# EAGLE design Routing_option1 (EAGLE 9.6.2)
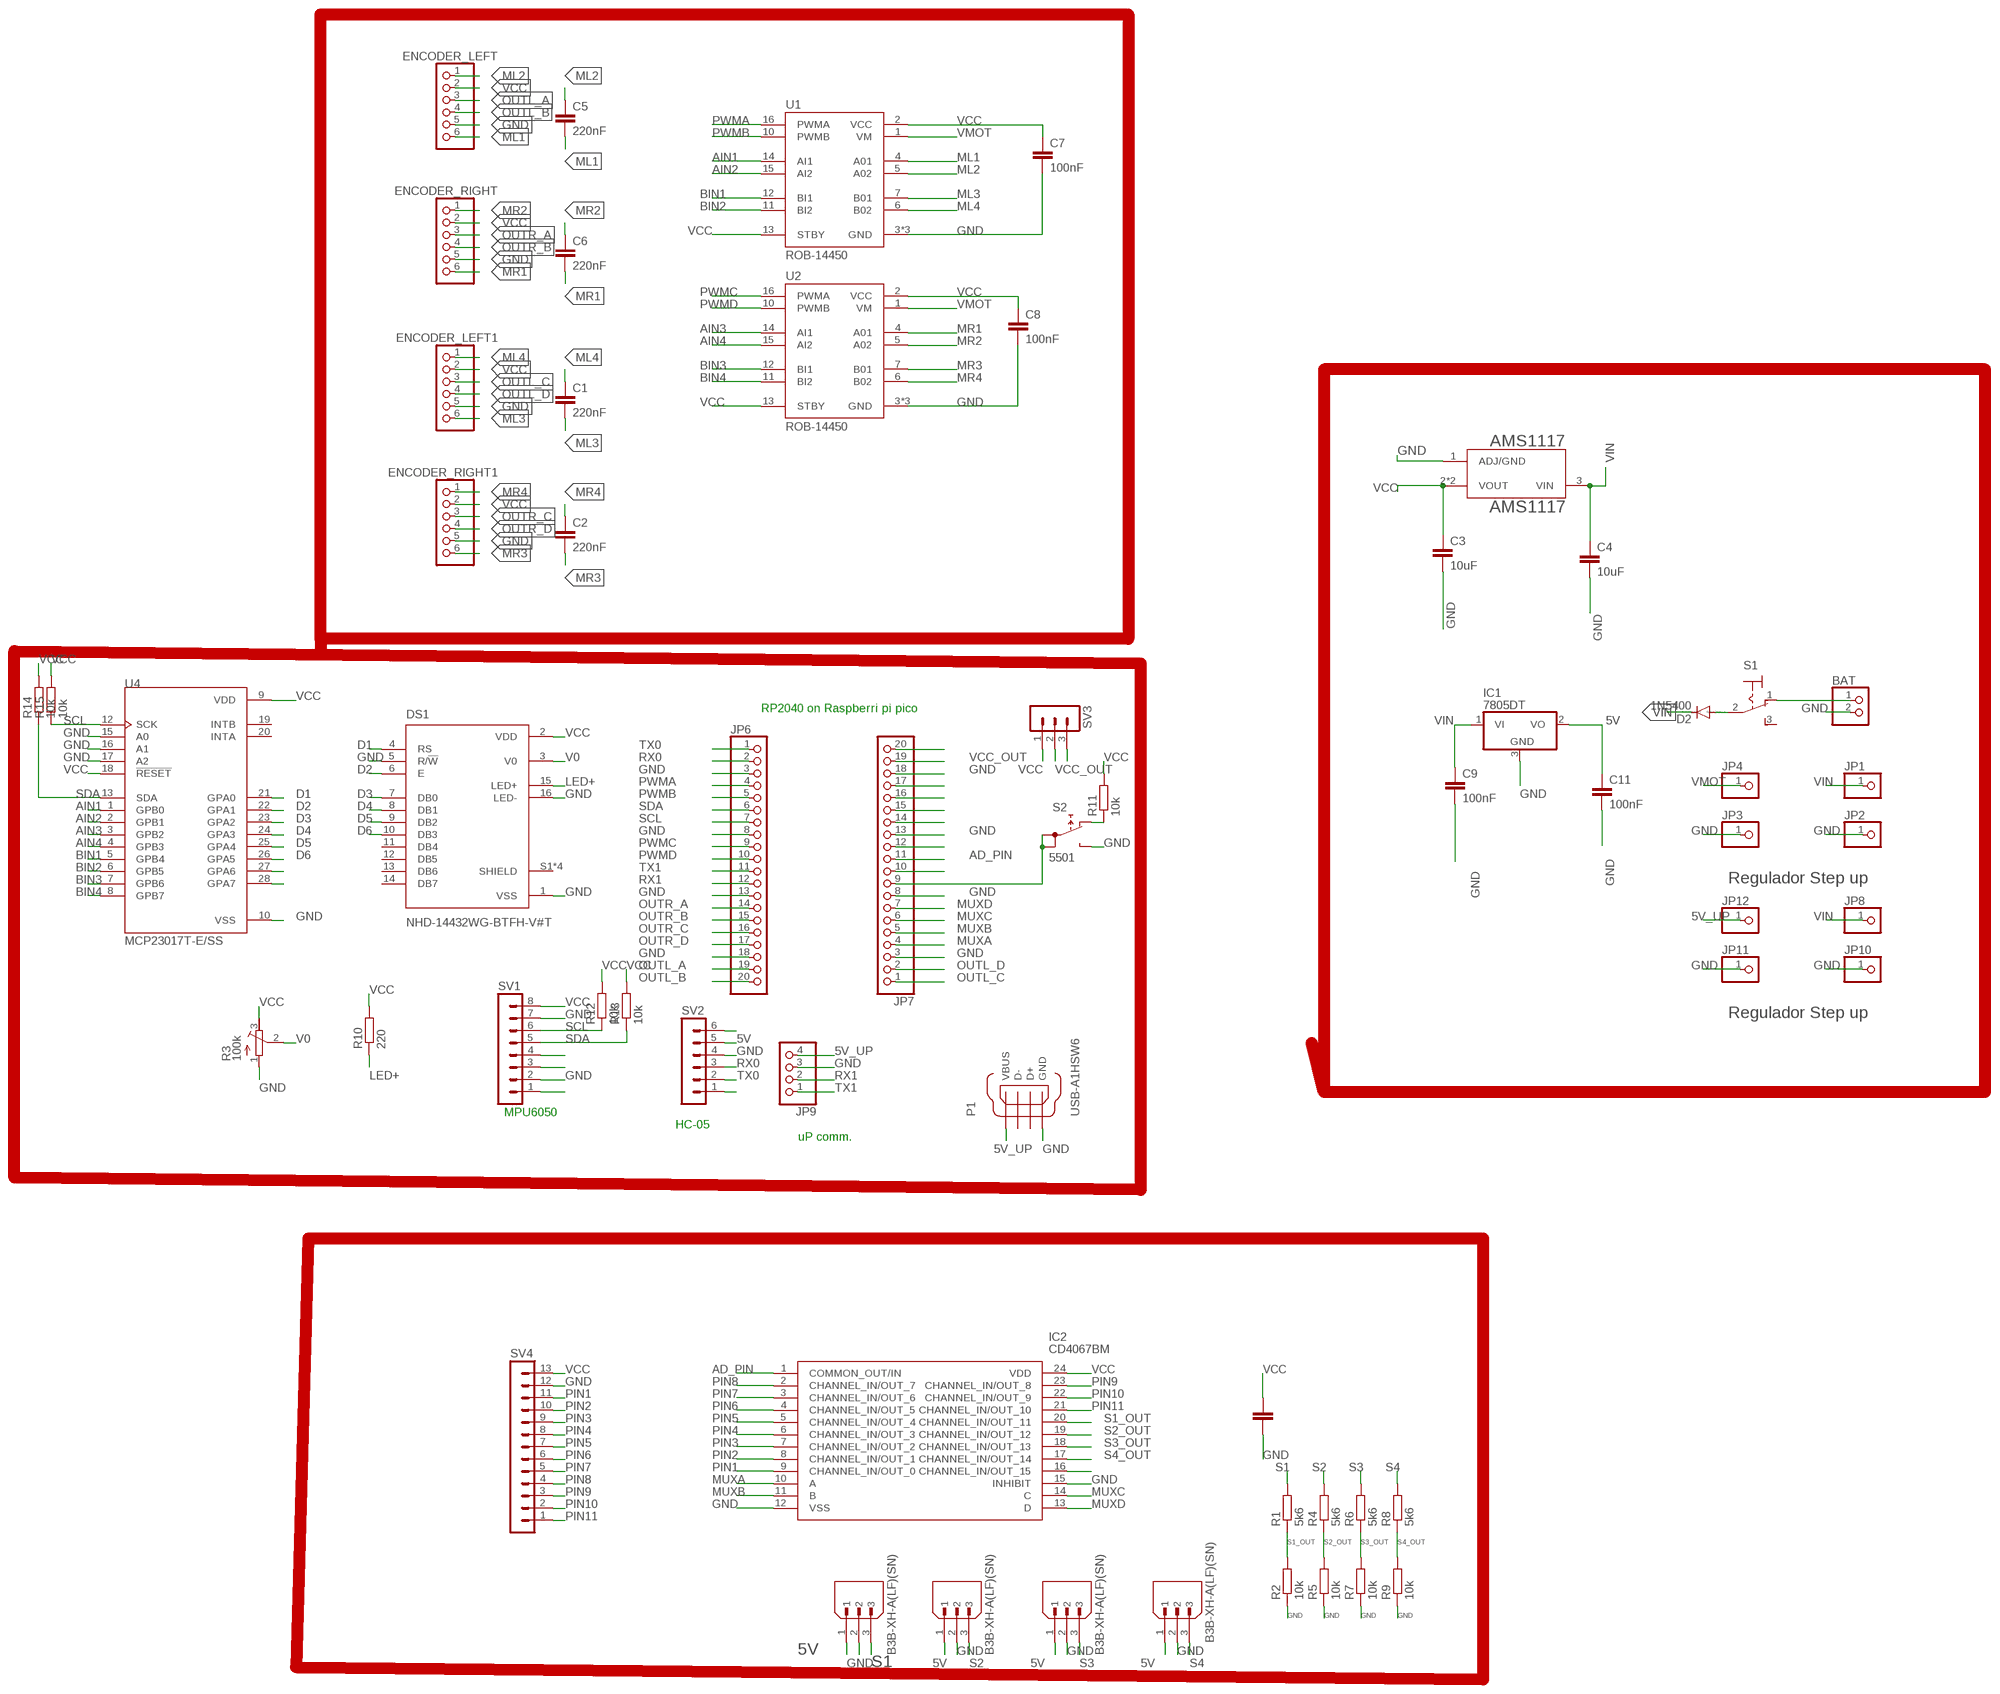
[diagram p0: schematic, sheet 1]

## Parts
AMS1117  AMS1117  [SOT229P700X180-4N]
BAT  PINHD-1X2  [1X02]
C1  220nF  C-EUC0805  [C0805]
C2  220nF  C-EUC0805  [C0805]
C3  10uF  C-EUC0805  [C0805]
C4  10uF  C-EUC0805  [C0805]
C5  220nF  C-EUC0805  [C0805]
C6  220nF  C-EUC0805  [C0805]
C7  100nF  C-EUC0805  [C0805]
C8  100nF  C-EUC0805  [C0805]
C9  100nF  C-EUC0805  [C0805]
C10  100nF  C-EUC0805  [C0805]
C11  100nF  C-EUC0805  [C0805]
D2  1N5400  [DO201-15]
DIR  B3B-XH-A(LF)(SN)  [JST_B3B-XH-A(LF)(SN)]
DS1  NHD-14432WG-BTFH-V#T  [LCD_NHD-14432WG-BTFH-V#T]
ENCODER_LEFT  PINHD-1X6  [1X06]
ENCODER_LEFT1  PINHD-1X6  [1X06]
ENCODER_RIGHT  PINHD-1X6  [1X06]
ENCODER_RIGHT1  PINHD-1X6  [1X06]
ESQ  B3B-XH-A(LF)(SN)  [JST_B3B-XH-A(LF)(SN)]
FRENT  B3B-XH-A(LF)(SN)  [JST_B3B-XH-A(LF)(SN)]
IC1  7805DT  [TO252]
IC2  CD4067BM  [SOIC127P1030X265-24N]
JP1  PINHD-1X1  [1X01]
JP2  PINHD-1X1  [1X01]
JP3  PINHD-1X1  [1X01]
JP4  PINHD-1X1  [1X01]
JP6  PINHD-1X20  [1X20]
JP7  PINHD-1X20  [1X20]
JP8  PINHD-1X1  [1X01]
JP9  PINHD-1X4  [1X04]
JP10  PINHD-1X1  [1X01]
JP11  PINHD-1X1  [1X01]
JP12  PINHD-1X1  [1X01]
P1  USB-A1HSW6  [OST_USB-A1HSW6]
R1  5k6  R-EU_R0805  [R0805]
R2  10k  R-EU_R0805  [R0805]
R3  100k  R-TRIMM64W  [RTRIM64W]
R4  5k6  R-EU_R0805  [R0805]
R5  10k  R-EU_R0805  [R0805]
R6  5k6  R-EU_R0805  [R0805]
R7  10k  R-EU_R0805  [R0805]
R8  5k6  R-EU_R0805  [R0805]
R9  10k  R-EU_R0805  [R0805]
R10  220  R-EU_R0805  [R0805]
R11  10k  R-EU_R0805  [R0805]
R12  10k  R-EU_R0805  [R0805]
R13  10k  R-EU_R0805  [R0805]
R14  10k  R-EU_R0805  [R0805]
R15  10k  R-EU_R0805  [R0805]
S1  320-916  [320-916]
S2  5501  [5501]
SV1  MA08-1  [MA08-1]
SV2  MA06-1  [MA06-1]
SV3  MA03-1  [MA03-1]
SV4  MA13-1  [MA13-1]
TRAS  B3B-XH-A(LF)(SN)  [JST_B3B-XH-A(LF)(SN)]
U1  ROB-14450  [MODULE_ROB-14450]
U2  ROB-14450  [MODULE_ROB-14450]
U4  MCP23017T-E/SS  [SOP65P780X200-28N]

## Nets
5V: C11.1 DIR.1 ESQ.1 FRENT.1 IC1.2(VO) SV2.5 TRAS.1
5V_UP: JP9.4 JP12.1 P1.1(VBUS)
AD1: JP7.12
AD2: JP7.14
AD_PIN: IC2.1(COMMON_OUT/IN) JP7.11
AIN1: U1.14(AI1) U4.1(GPB0)
AIN2: U1.15(AI2) U4.2(GPB1)
AIN3: U2.14(AI1) U4.3(GPB2)
AIN4: U2.15(AI2) U4.4(GPB3)
BIN1: U1.12(BI1) U4.5(GPB4)
BIN2: U1.11(BI2) U4.6(GPB5)
BIN3: U2.12(BI1) U4.7(GPB6)
BIN4: U2.11(BI2) U4.8(GPB7)
D1: DS1.4(RS) U4.21(GPA0)
D2: DS1.6(E) U4.22(GPA1)
D3: DS1.7(DB0) U4.23(GPA2)
D4: DS1.8(DB1) U4.24(GPA3)
D5: DS1.9(DB2) U4.25(GPA4)
D6: DS1.10(DB3) U4.26(GPA5)
GND: AMS1117.1(ADJ/GND) BAT.2 C3.2 C4.2 C7.2 C8.2 C9.2 C10.2 C11.2 DIR.2 DS1.1(VSS) DS1.5(R/!W) DS1.16(LED-) ENCODER_LEFT1.5 ENCODER_LEFT.5 ENCODER_RIGHT1.5 ENCODER_RIGHT.5 ESQ.2 FRENT.2 IC1.3(GND) IC2.12(VSS) IC2.15(INHIBIT) JP2.1 JP3.1 JP6.3 JP6.8 JP6.13 JP6.18 JP7.3 JP7.8 JP7.13 JP7.18 JP9.3 JP10.1 JP11.1 P1.4(GND) R2.1 R3.1(A) R5.1 R7.1 R9.1 S2.NO SV1.2 SV1.7 SV2.4 SV4.12 TRAS.2 U1.3(GND) U1.8(GND) U1.9(GND) U2.3(GND) U2.8(GND) U2.9(GND) U4.10(VSS) U4.15(A0) U4.16(A1) U4.17(A2)
LED+: DS1.15(LED+) R10.1
ML1: C5.2 ENCODER_LEFT.6 U1.4(A01)
ML2: C5.1 ENCODER_LEFT.1 U1.5(A02)
ML3: C1.2 ENCODER_LEFT1.6 U1.7(B01)
ML4: C1.1 ENCODER_LEFT1.1 U1.6(B02)
MR1: C6.2 ENCODER_RIGHT.6 U2.4(A01)
MR2: C6.1 ENCODER_RIGHT.1 U2.5(A02)
MR3: C2.2 ENCODER_RIGHT1.6 U2.7(B01)
MR4: C2.1 ENCODER_RIGHT1.1 U2.6(B02)
MUXA: IC2.10(A) JP7.4
MUXB: IC2.11(B) JP7.5
MUXC: IC2.14(C) JP7.6
MUXD: IC2.13(D) JP7.7
N$2: D2.A S1.2(P)
N$3: BAT.1 S1.1(O)
N$4: R11.1 S2.NC
N$5: SV3.3
N$13: SV1.4
N$14: SV1.3
N$16: SV1.1
N$17: SV2.6
N$26: SV2.1
N$47: U4.27(GPA6)
N$48: U4.28(GPA7)
NET$4: JP7.20
NET$5: JP7.17
NET$6: JP7.16
NET$7: JP7.15
NET$8: JP7.10
NET$15: JP7.9 S2.1A S2.1B
OUTL_A: ENCODER_LEFT.3 JP6.19
OUTL_B: ENCODER_LEFT.4 JP6.20
OUTL_C: ENCODER_LEFT1.3 JP7.1
OUTL_D: ENCODER_LEFT1.4 JP7.2
OUTR_A: ENCODER_RIGHT.3 JP6.14
OUTR_B: ENCODER_RIGHT.4 JP6.15
OUTR_C: ENCODER_RIGHT1.3 JP6.16
OUTR_D: ENCODER_RIGHT1.4 JP6.17
PIN1: IC2.9(CHANNEL_IN/OUT_0) SV4.11
PIN2: IC2.8(CHANNEL_IN/OUT_1) SV4.10
PIN3: IC2.7(CHANNEL_IN/OUT_2) SV4.9
PIN4: IC2.6(CHANNEL_IN/OUT_3) SV4.8
PIN5: IC2.5(CHANNEL_IN/OUT_4) SV4.7
PIN6: IC2.4(CHANNEL_IN/OUT_5) SV4.6
PIN7: IC2.3(CHANNEL_IN/OUT_6) SV4.5
PIN8: IC2.2(CHANNEL_IN/OUT_7) SV4.4
PIN9: IC2.23(CHANNEL_IN/OUT_8) SV4.3
PIN10: IC2.22(CHANNEL_IN/OUT_9) SV4.2
PIN11: IC2.21(CHANNEL_IN/OUT_10) SV4.1
PWMA: JP6.4 U1.16(PWMA)
PWMB: JP6.5 U1.10(PWMB)
PWMC: JP6.9 U2.16(PWMA)
PWMD: JP6.10 U2.10(PWMB)
RX0: JP6.2 SV2.3
RX1: JP6.12 JP9.2
S1: FRENT.3 R1.2
S1_OUT: IC2.20(CHANNEL_IN/OUT_11) R1.1 R2.2
S2: ESQ.3 R4.2
S2_OUT: IC2.19(CHANNEL_IN/OUT_12) R4.1 R5.2
S3: DIR.3 R6.2
S3_OUT: IC2.18(CHANNEL_IN/OUT_13) R6.1 R7.2
S4: R8.2 TRAS.3
S4_OUT: IC2.17(CHANNEL_IN/OUT_14) R8.1 R9.2
S5: IC2.16(CHANNEL_IN/OUT_15)
SCL: JP6.7 R12.1 R15.1 SV1.6 U4.12(SCK)
SDA: JP6.6 R13.1 R14.1 SV1.5 U4.13(SDA)
TX0: JP6.1 SV2.2
TX1: JP6.11 JP9.1
V0: DS1.3(V0) R3.2(S)
VCC: AMS1117.2(VOUT) AMS1117.4(VOUT) C3.1 C7.1 C8.1 C10.1 DS1.2(VDD) ENCODER_LEFT1.2 ENCODER_LEFT.2 ENCODER_RIGHT1.2 ENCODER_RIGHT.2 IC2.24(VDD) R3.3(E) R10.2 R11.2 R12.2 R13.2 R14.2 R15.2 SV1.8 SV3.1 SV4.13 U1.2(VCC) U1.13(STBY) U2.2(VCC) U2.13(STBY) U4.9(VDD) U4.18(!RESET)
VCC_OUT: JP7.19 SV3.2
VIN: AMS1117.3(VIN) C4.1 C9.1 D2.C IC1.1(VI) JP1.1 JP8.1
VMOT: JP4.1 U1.1(VM) U2.1(VM)
Unconnected: DS1.11(DB4) DS1.12(DB5) DS1.13(DB6) DS1.14(DB7) DS1.S1(SHIELD) DS1.S2(SHIELD) DS1.S3(SHIELD) DS1.S4(SHIELD) P1.2(D-) P1.3(D+) S1.3(S) U4.19(INTB) U4.20(INTA)

## Notes on the sheet
- RP2040 on Raspberri pi pico
- Regulador Step up
- Regulador Step up
- MPU6050
- HC-05
- uP comm.

## Library data of the parts
AMS1117 = AMS1117_REGULADOR:AMS1117: Sot223/Pkg 1-Amp 5-Volt Low Drop Out Voltage Regulatator Check prices <https://pricing.snapeda.com/parts/AMS1117/Advanced%20Monolithic%20Systems/view-part?ref=eda>; AVAILABILITY: In Stock; DESCRIPTION: 1A LOW DROPOUT VOLTAGE REGULATOR SOT-223; MF: Advanced Monolithic Systems; MP: AMS1117; PACKAGE: SOT-223 Seeed Technology; PRICE: None
BAT = pinhead:PINHD-1X2: PIN HEADER
C1-C11 = rcl:C-EU: CAPACITOR, European symbol; SPICEPREFIX: C
D2 = diode:1N5400: DIODE standard rectifier, 3 A, 50 V (Motorola)
DIR ESQ FRENT TRAS = B3B-XH-A_LF__SN_:B3B-XH-A(LF)(SN): Check availability <https://pricing.snapeda.com/parts/B3B-XH-A%28LF%29%28SN%29/JST%20Sales/view-part?ref=eda>; AVAILABILITY: In Stock; DESCRIPTION: Connector Header Through Hole 3 position 0.098 (2.50mm); MF: JST Sales; MP: B3B-XH-A(LF)(SN); PACKAGE: None; PRICE: None; PURCHASE-URL: https://pricing.snapeda.com/search/part/B3B-XH-A(LF)(SN)/?ref=eda
DS1 = NHD-14432WG-BTFH-V_T:NHD-14432WG-BTFH-V#T: LCD Graphic Display; 144x32 Pixels; 80x36; FSTN (+); Transflective; 8-Bit Parallel Check availability <https://pricing.snapeda.com/parts/NHD-14432WG-BTFH-V%23T/Newhaven%20Display/view-part?ref=eda>; AVAILABILITY: In Stock; DESCRIPTION: - Graphic LCD Display Module Transflective Black (White - Inverted) FSTN - Film Super-Twisted Nematic Parallel, 8-Bit - 144 x 32; MF: Newhaven Display; MP: NHD-14432WG-BTFH-V#T; PACKAGE: None; PRICE: None; PURCHASE-URL: https://pricing.snapeda.com/search?q=NHD-14432WG-BTFH-V#T&ref=eda
ENCODER_LEFT ENCODER_LEFT1 ENCODER_RIGHT ENCODER_RIGHT1 = pinhead:PINHD-1X6: PIN HEADER
IC1 = linear:78*: Positive VOLTAGE REGULATOR Source: http://cache.national.com/ds/LM/LM78L05.pdf http://www.fairchildsemi.com/ds/LM/LM7805.pdf
IC2 = CD4067BM:CD4067BM: Analog Multiplexer/Demultiplexer SOIC24 Texas Instruments CD4067BM, Multiplexer/Demultiplexer Single 16:1, 3 18 V, 24-Pin SOIC Source: Datasheet <http://www.ti.com/lit/ds/symlink/cd4067b.pdf>; ARROW_PART_NUMBER: CD4067BM; ARROW_PRICE-STOCK: https://www.arrow.com/en/products/cd4067bm/texas-instruments; DESCRIPTION: Analog Multiplexer/Demultiplexer SOIC24 Texas Instruments CD4067BM, Multiplexer/Demultiplexer Single 16:1, 3 18 V, 24-Pin SOIC; HEIGHT: 2.65mm; MANUFACTURER_NAME: Texas Instruments; MANUFACTURER_PART_NUMBER: CD4067BM; MOUSER_PART_NUMBER: 595-CD4067BM; MOUSER_PRICE-STOCK: https://www.mouser.co.uk/ProductDetail/Texas-Instruments/CD4067BM?qs=LSR%252BNeaw%2FwBojsvkXxI5Ew%3D%3D
JP1-JP4 JP8 JP10-JP12 = pinhead:PINHD-1X1: PIN HEADER
JP6 JP7 = pinhead:PINHD-1X20: PIN HEADER
JP9 = pinhead:PINHD-1X4: PIN HEADER
P1 = USB-A1HSW6:USB-A1HSW6: USB - A Receptacle Connector 4 Position Through Hole, Right Angle Check availability <https://pricing.snapeda.com/parts/USB-A1HSW6/On%20Shore/view-part?ref=eda>; AVAILABILITY: In Stock; DESCRIPTION: USB-A (USB TYPE-A) - Receptacle Connector 4 Position Through Hole, Right Angle; MF: On Shore; MP: USB-A1HSW6; PACKAGE: None; PRICE: None; PURCHASE-URL: https://pricing.snapeda.com/search?q=USB-A1HSW6&ref=eda
R1 R2 R4-R15 = rcl:R-EU_: RESISTOR, European symbol; SPICEPREFIX: R
R3 = rcl:R-TRIMM: Trimm resistor; SPICEMODEL: X; SPICEPREFIXL: POT
S1 = switch:320-916: TOGGLE SWITCH distributor RS Components
S2 = switch:55?: PUSHBUTTON SERIES 5500 SWITCHES Source: www.e-switch.com .. 5500.pdf
SV1 = con-lstb:MA08-1: PIN HEADER; OC_FARNELL: unknown; OC_NEWARK: unknown
SV2 = con-lstb:MA06-1: PIN HEADER; OC_FARNELL: unknown; OC_NEWARK: unknown
SV3 = con-lstb:MA03-1: PIN HEADER; OC_FARNELL: unknown; OC_NEWARK: unknown
SV4 = con-lstb:MA13-1: PIN HEADER; OC_FARNELL: unknown; OC_NEWARK: unknown
U1 U2 = ROB-14450:ROB-14450: TB6612FNG Motor Controller/Driver Power Management Evaluation Board Check availability <https://pricing.snapeda.com/parts/ROB-14450/SparkFun%20Electronics/view-part?ref=eda>; AVAILABILITY: In Stock; DESCRIPTION: TB6612FNG Motor Controller/Driver Power Management Evaluation Board; MF: SparkFun Electronics; MP: ROB-14450; PACKAGE: None; PRICE: None; PURCHASE-URL: https://pricing.snapeda.com/search/part/ROB-14450/?ref=eda
U4 = MCP23017T-E_SS:MCP23017T-E/SS: 16-bit Input/Output Expander, I2C interface, Pb-free28 SSOP .209in T/R Check availability <https://pricing.snapeda.com/parts/MCP23017T-E/SS/Microchip/view-part?ref=eda>; AVAILABILITY: In Stock; DESCRIPTION: I/O Expander 16 I²C 1.7 MHz 28-SSOP; MF: Microchip; MP: MCP23017T-E/SS; PACKAGE: SSOP-28 Microchip; PRICE: None; PURCHASE-URL: https://pricing.snapeda.com/search?q=MCP23017T-E/SS&ref=eda

## Board
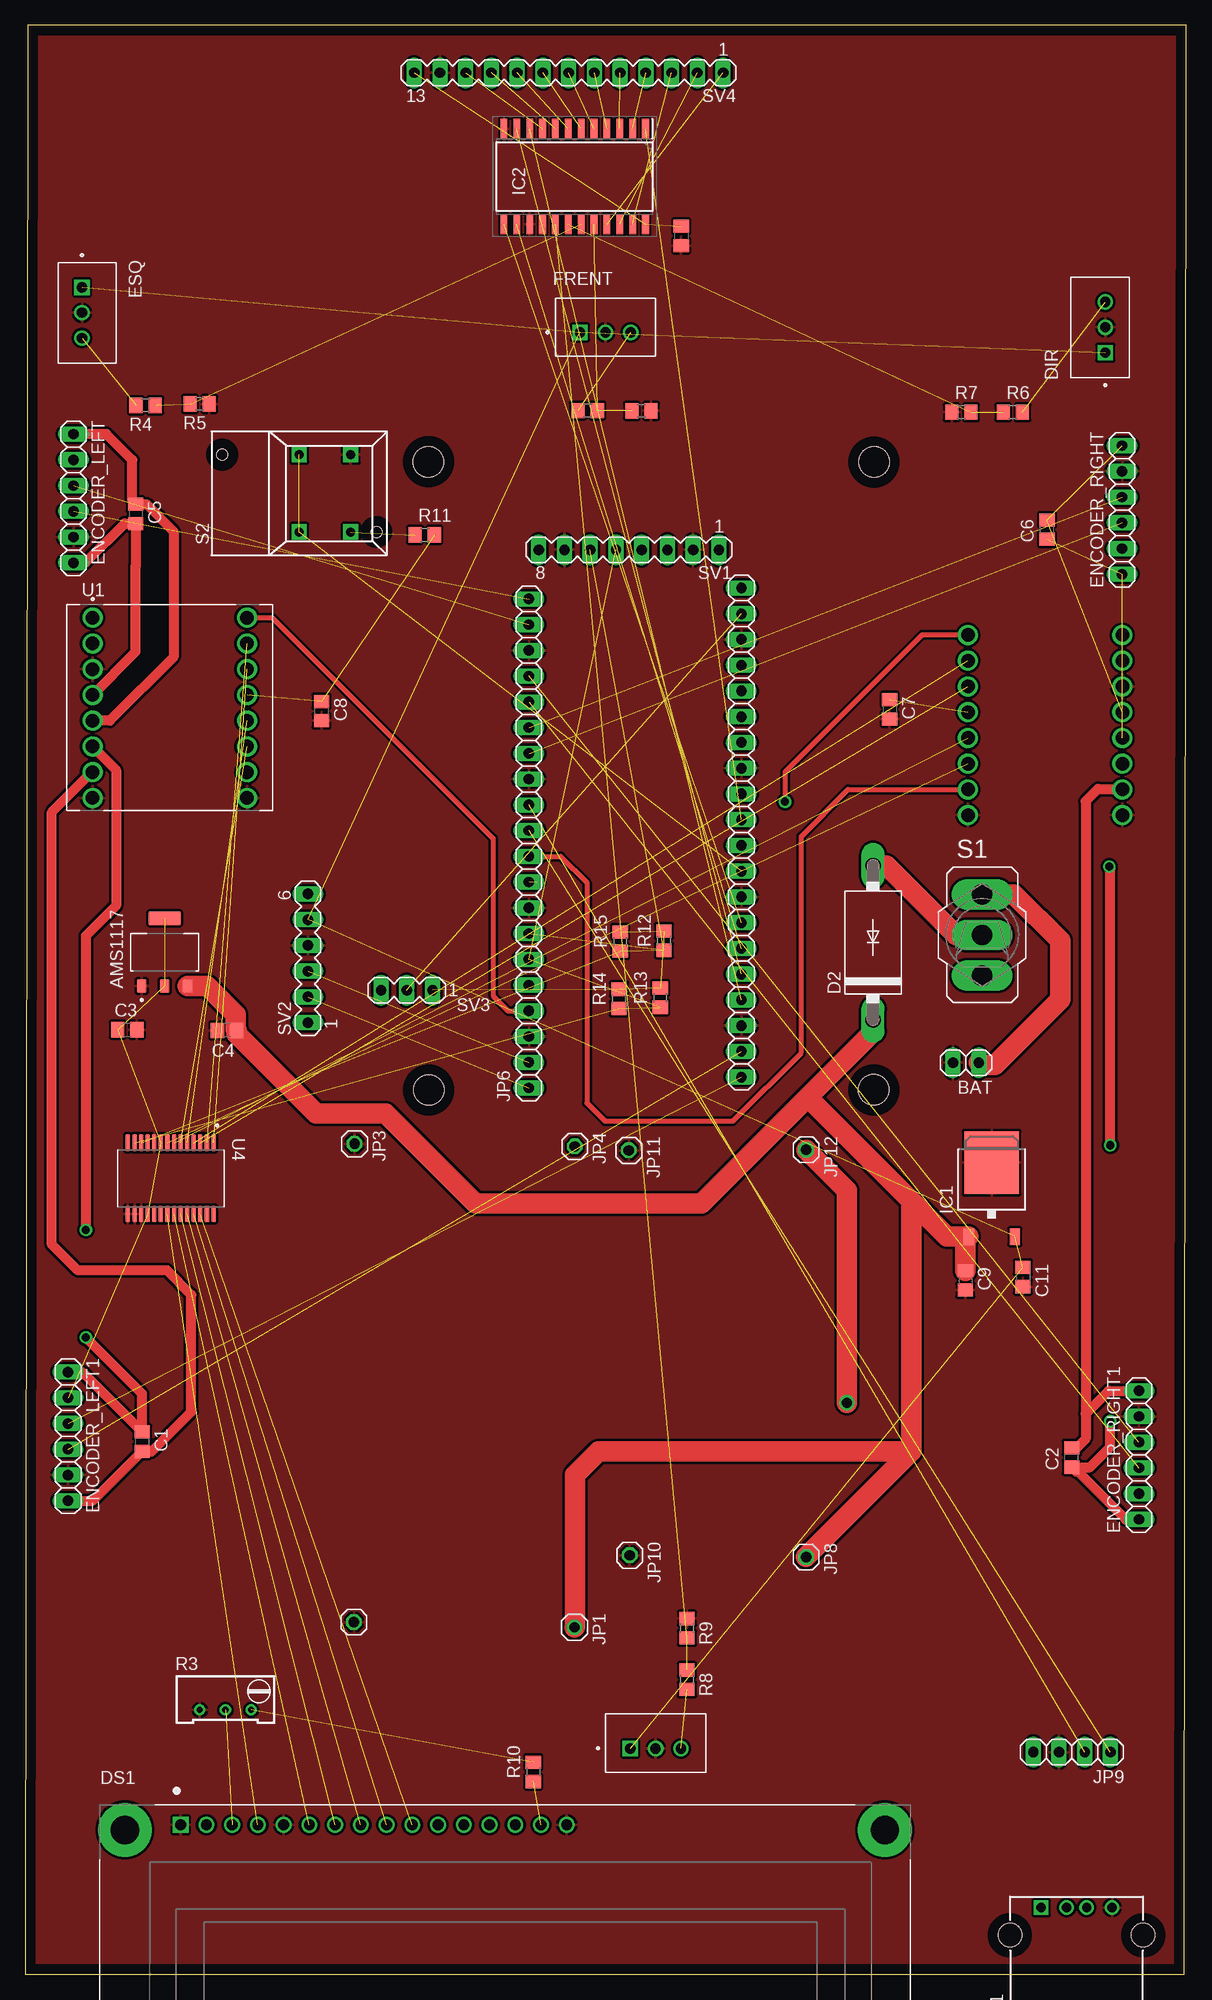
[diagram p1: board, top side]
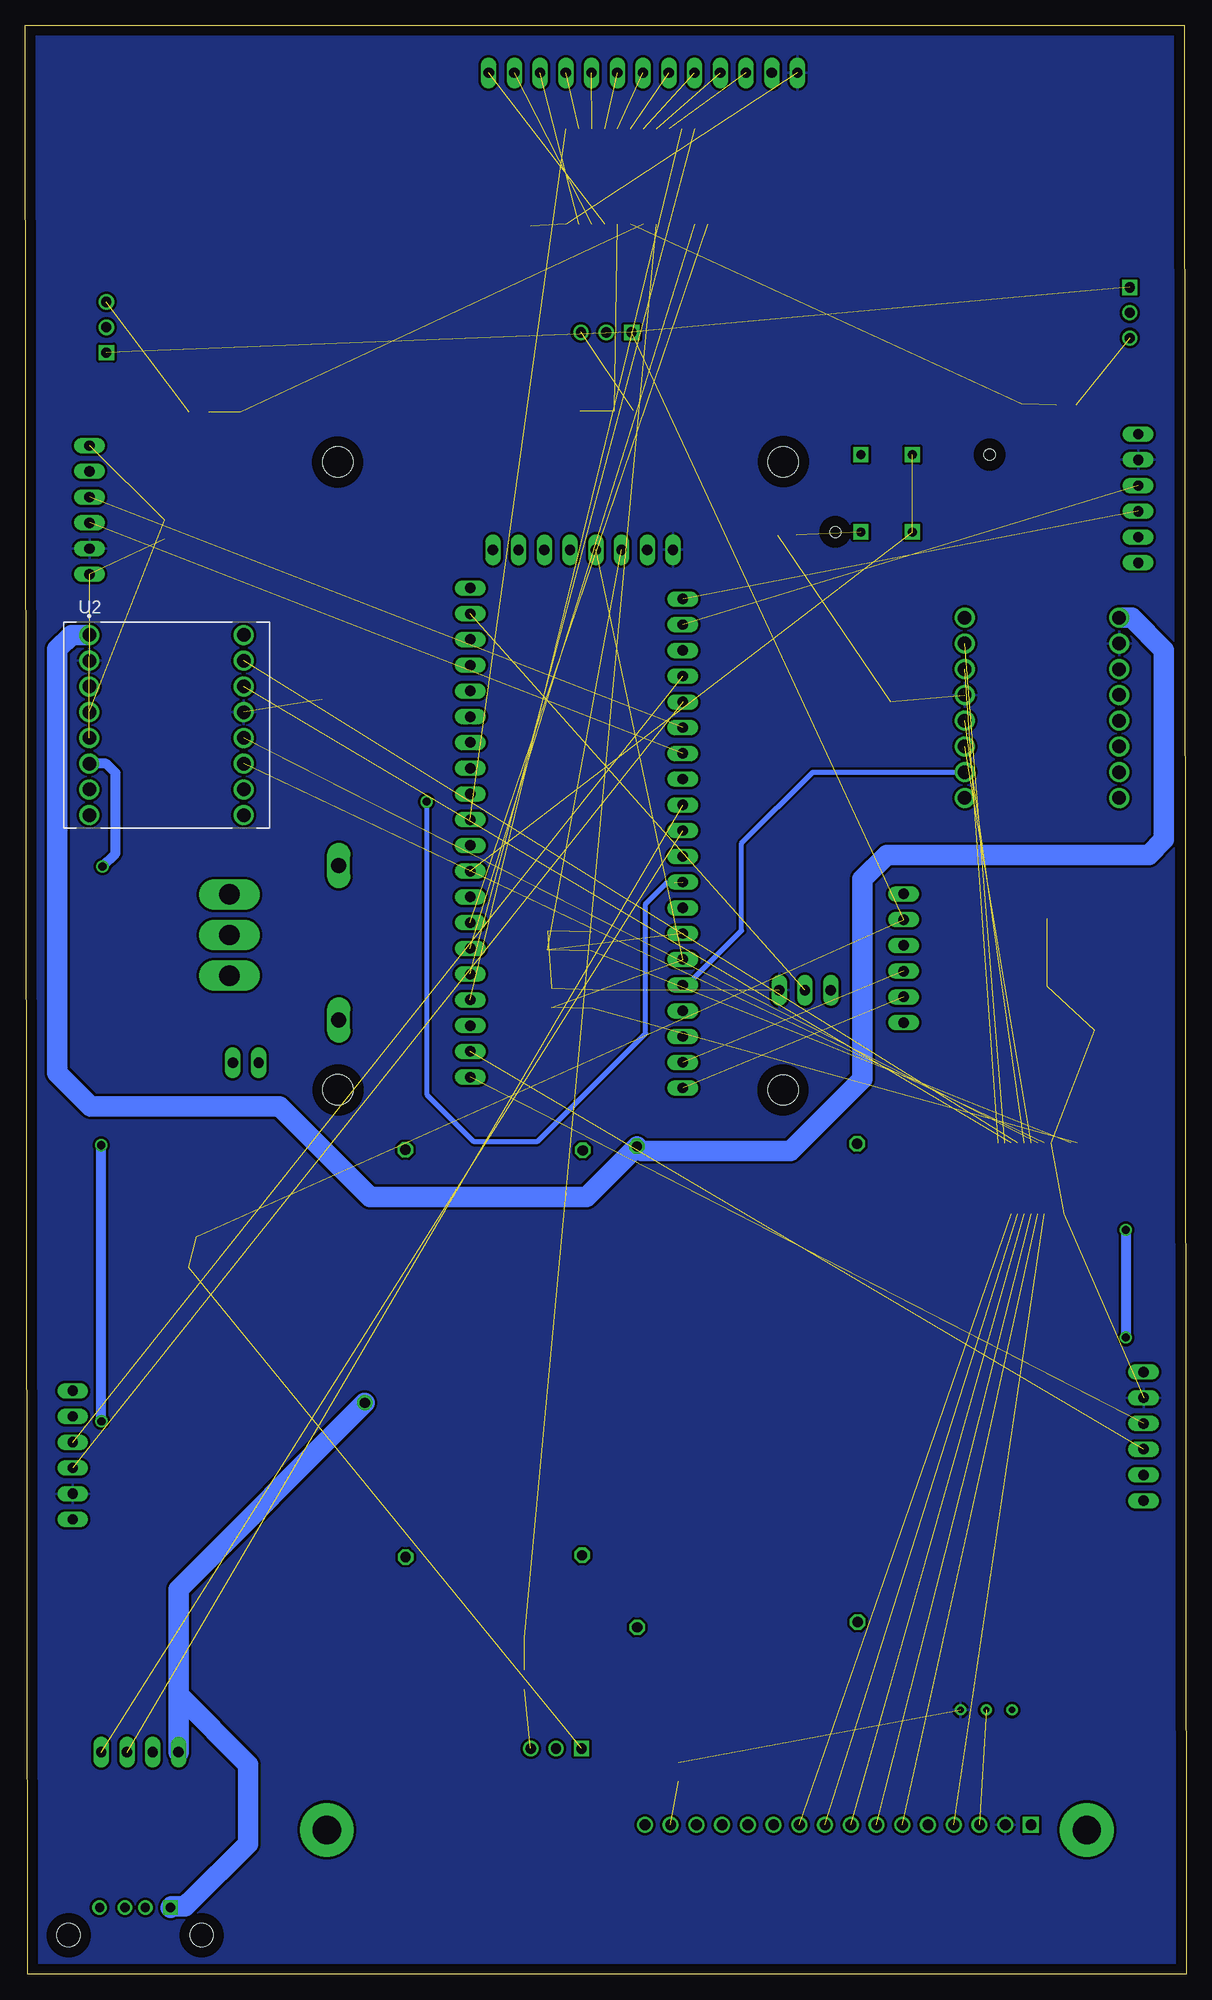
[diagram p2: board, bottom side, seen from below]

Size 114.58 x 192.29 mm. Coordinates in mm from the lower left corner, seen from the top.
Outline: 0,0 114.35,0 114.58,192.29 0.23,192.29 0,0
Copper layers (1*16): Top 0.035mm / dielectric 1.5mm / Bottom 0.035mm
Design rules "default *": minimum track width 0.3mm, minimum drill 0.35mm, track to track 0.25mm, track to pad 0.25mm, pad to pad 0.25mm, via to via 0.25mm, smd to smd 0.25mm, copper to edge 40mil, drill to drill 6mil, minimum pad ring 10mil, minimum via ring 8mil, stop-mask expansion 4mil, vias tented up to drill 0mil, thermal gap 10mil
Holes 3 mm at 39.78,149.23 39.8,87.24 83.72,87.27 83.75,149.2

### Footprints (pad centres in the part's own frame; a part is rotated, then mirrored left to right if it is on the bottom)
SOT229P700X180-4N = smd 1.31 x 0.93: 1 -3.345,2.29; 2 -3.345,0; 3 -3.345,-2.29 | smd 1.31 x 3.24: 4 3.345,0
1X02 = drill 1.016 long: 1 -1.27,0; 2 1.27,0
C0805 = smd 1.3 x 1.5: 1 -0.95,0; 2 0.95,0
DO201-15 = drill 1.499 long: A 7.62,0; C -7.62,0
JST_B3B-XH-A(LF)(SN) = drill 1 square: 1 -2.5,-0.525 | drill 1: 2 0,-0.525; 3 2.5,-0.525
LCD_NHD-14432WG-BTFH-V#T = drill 1.05 square: 1 -32.55,16.3 | drill 1.05: 2 -30.01,16.3; 3 -27.47,16.3; 4 -24.93,16.3; 5 -22.39,16.3; 6 -19.85,16.3; 7 -17.31,16.3; 8 -14.77,16.3; 9 -12.23,16.3; 10 -9.69,16.3; 11 -7.15,16.3; 12 -4.61,16.3; 13 -2.07,16.3; 14 0.47,16.3; 15 3.01,16.3; 16 5.55,16.3 | drill 2.8 pad 5.3: S1 -38.05,15.8; S2 -38.05,-15.2; S3 36.95,15.8; S4 36.95,-15.2
1X06 = drill 1.016 long: 1 -6.35,0; 2 -3.81,0; 3 -1.27,0; 4 1.27,0; 5 3.81,0; 6 6.35,0
TO252 = smd 1 x 1.6: 1 -2.28,-4.8; 2 2.28,-4.8 | smd 5.4 x 6.2: 3 0,2.5
SOIC127P1030X265-24N = smd 1.95 x 0.65: 1 -4.725,6.985; 2 -4.725,5.715; 3 -4.725,4.445; 4 -4.725,3.175; 5 -4.725,1.905; 6 -4.725,0.635; 7 -4.725,-0.635; 8 -4.725,-1.905; 9 -4.725,-3.175; 10 -4.725,-4.445; 11 -4.725,-5.715; 12 -4.725,-6.985; 13 4.725,-6.985; 14 4.725,-5.715; 15 4.725,-4.445; 16 4.725,-3.175; 17 4.725,-1.905; 18 4.725,-0.635; 19 4.725,0.635; 20 4.725,1.905; 21 4.725,3.175; 22 4.725,4.445; 23 4.725,5.715; 24 4.725,6.985
1X01 = drill 1.016 octagon: 1 0,0
1X20 = drill 1.016 long: 1 -24.13,0; 2 -21.59,0; 3 -19.05,0; 4 -16.51,0; 5 -13.97,0; 6 -11.43,0; 7 -8.89,0; 8 -6.35,0; 9 -3.81,0; 10 -1.27,0; 11 1.27,0; 12 3.81,0; 13 6.35,0; 14 8.89,0; 15 11.43,0; 16 13.97,0; 17 16.51,0; 18 19.05,0; 19 21.59,0; 20 24.13,0
1X04 = drill 1.016 long: 1 -3.81,0; 2 -1.27,0; 3 1.27,0; 4 3.81,0
OST_USB-A1HSW6 = drill 0.92 square: 1 -3.5,6.51 | drill 0.92: 2 -1,6.51; 3 1,6.51; 4 3.5,6.51 | hole 2.3: -6.57,3.8; 6.57,3.8
R0805 = smd 1.3 x 1.5: 1 -0.95,0; 2 0.95,0
RTRIM64W = drill 0.61: 1 1.27,-2.54; 2 1.27,0; 3 1.27,2.54
320-916 = drill 2.007 long: 1 0,4.013; 2 0,0; 3 0,-4.013
5501 = drill 0.9 pad 1.5 square: 1A 0,3.81; 1B 0,-3.81; NC 5.08,-3.81; NO 5.08,3.81 | hole 1.1: -7.62,3.81; 7.62,-3.81
MA08-1 = drill 1.016 long: 1 -8.89,0; 2 -6.35,0; 3 -3.81,0; 4 -1.27,0; 5 1.27,0; 6 3.81,0; 7 6.35,0; 8 8.89,0
MA06-1 = drill 1.016 long: 1 -6.35,0; 2 -3.81,0; 3 -1.27,0; 4 1.27,0; 5 3.81,0; 6 6.35,0
MA03-1 = drill 1.016 long: 1 -2.54,0; 2 0,0; 3 2.54,0
MA13-1 = drill 1.016 long: 1 -15.24,0; 2 -12.7,0; 3 -10.16,0; 4 -7.62,0; 5 -5.08,0; 6 -2.54,0; 7 0,0; 8 2.54,0; 9 5.08,0; 10 7.62,0; 11 10.16,0; 12 12.7,0; 13 15.24,0
MODULE_ROB-14450 = drill 1.32: 1 -7.62,8.89; 2 -7.62,6.35; 3 -7.62,3.81; 4 -7.62,1.27; 5 -7.62,-1.27; 6 -7.62,-3.81; 7 -7.62,-6.35; 8 -7.62,-8.89; 9 7.62,-8.89; 10 7.62,-6.35; 11 7.62,-3.81; 12 7.62,-1.27; 13 7.62,1.27; 14 7.62,3.81; 15 7.62,6.35; 16 7.62,8.89
SOP65P780X200-28N = smd 1.651 x 0.432: 1 -3.505,4.225; 2 -3.505,3.575; 3 -3.505,2.925; 4 -3.505,2.275; 5 -3.505,1.625; 6 -3.505,0.975; 7 -3.505,0.325; 8 -3.505,-0.325; 9 -3.505,-0.975; 10 -3.505,-1.625; 11 -3.505,-2.275; 12 -3.505,-2.925; 13 -3.505,-3.575; 14 -3.505,-4.225; 15 3.505,-4.225; 16 3.505,-3.575; 17 3.505,-2.925; 18 3.505,-2.275; 19 3.505,-1.625; 20 3.505,-0.975; 21 3.505,-0.325; 22 3.505,0.325; 23 3.505,0.975; 24 3.505,1.625; 25 3.505,2.275; 26 3.505,2.925; 27 3.505,3.575; 28 3.505,4.225

### Placement (x,y rotation side)
AMS1117  13.75,100.83 90 top
BAT  92.82,89.93 180 top
C1  11.53,52.54 270 top
C2  103.26,50.98 90 top
C3  10.06,93.18 0 top
C4  19.9,93.12 180 top
C5  10.89,144.08 270 top
C6  100.82,142.53 90 top
C7  85.29,124.8 270 top
C8  29.23,124.63 270 top
C9  92.77,68.45 270 top
C10  64.72,171.51 270 top
C11  98.45,68.78 270 top
D2  83.66,101.77 90 top
DIR  106.06,162.49 90 top
DS1  47.88,-1.57 0 top
ENCODER_LEFT  4.75,145.61 270 top
ENCODER_LEFT1  4.22,53.06 270 top
ENCODER_RIGHT  108.24,144.47 90 top
ENCODER_RIGHT1  109.9,51.22 90 top
ESQ  6.12,163.93 270 top
FRENT  57.25,162.51 0 top
IC1  95.36,77.57 0 top
IC2  54.21,177.37 270 top
JP1  54.2,34.22 270 top
JP2  32.43,34.73 270 top
JP3  32.49,81.93 270 top
JP4  54.22,81.67 270 top
JP6  49.69,111.56 90 top
JP7  70.67,112.64 90 top
JP8  77.05,41.15 270 top
JP9  103.27,21.91 180 top
JP10  59.64,41.33 270 top
JP11  59.56,81.28 270 top
JP12  77.06,81.34 270 top
P1  103.74,0.06 0 top
R1  55.49,154.28 180 top
R2  60.81,154.25 180 top
R3  19.75,27.34 270 top
R4  11.87,154.79 180 top
R5  17.2,154.93 180 top
R6  97.45,154.11 0 top
R7  92.37,154.11 0 top
R8  65.29,29.05 270 top
R9  65.29,34.13 270 top
R10  50.13,19.96 90 top
R11  39.42,142 0 top
R12  63.03,101.98 90 top
R13  62.66,96.35 90 top
R14  58.59,96.23 90 top
R15  58.71,101.89 90 top
S1  94.43,102.54 0 top
S2  27.03,146.11 0 top
SV1  59.55,140.54 180 top
SV2  27.89,100.24 90 top
SV3  37.64,97.08 180 top
SV4  53.61,187.6 180 top
TRAS  62.2,22.79 0 top
U1  14.25,124.95 0 top
U2  100.64,123.25 0 bottom
U4  14.35,78.52 270 top

### Tracks (layer width: path | path; a pad name or v marks a point on that pad's centre or on a via)
5V  (6 unrouted)
5V_UP  (via drill 1)
  Top 2: JP12.1 81.07,77.33 v81.07,56.38
  Bottom 2: v81.07,56.38 99.46,37.99 99.46,27.54 | 99.46,27.54 JP9.4 | 99.46,27.54 92.6,20.67 92.6,12.88 98.45,7.02 98.48,7.02 98.82,6.69 100.12,6.69 P1.1
AD_PIN  (1 unrouted)
AIN1  (1 unrouted)
AIN2  (1 unrouted)
AIN3  (1 unrouted)
AIN4  (1 unrouted)
BIN1  (1 unrouted)
BIN2  (1 unrouted)
BIN3  (1 unrouted)
BIN4  (1 unrouted)
D1  (1 unrouted)
D2  (1 unrouted)
D3  (1 unrouted)
D4  (1 unrouted)
D5  (1 unrouted)
D6  (1 unrouted)
GND
  pour Top: -7.54,-8.38 -7.54,200.21 133.1,200.21 133.1,-30.92 -7.53,-30.92 -7.53,-8.19
LED+  (1 unrouted)
ML1
  Top 1: U1.4 10.86,130.45 10.86,138.91 10.89,138.95 C5.2 9.79,143.13 5.91,139.26 ENCODER_LEFT.6
ML2
  Top 1: U1.5 8.34,123.68 14.64,129.98 14.64,142.35 11.96,145.03 C5.1 10.56,145.37 10.56,149.39 7.99,151.96 ENCODER_LEFT.1
ML3
  Top 1: ENCODER_LEFT1.6 6.64,46.71 C1.2 11.56,51.56 12.45,51.56 16.38,55.49 16.38,67.04 13.99,69.44 5.18,69.44 2.62,72 2.62,114.65 6.57,118.6 U1.7
ML4  (via drill 0.8)
  Top 1: U1.6 8.95,118.82 8.95,105.42 5.98,102.45 v5.98,73.44 | v5.98,62.82 11.52,57.27 C1.1 5.61,59.41 ENCODER_LEFT1.1
  Bottom 1: v5.98,73.44 v5.98,62.82
MR1  (2 unrouted)
MR2  (2 unrouted)
MR3
  Top 1: C2.2 103.74,51.93 104.63,52.82 104.63,55.29 | 104.63,55.29 104.63,115.74 105.84,116.95 108.21,116.95 U2.7 | 104.63,55.29 106.91,57.57 ENCODER_RIGHT1.6
MR4  (via drill 0.8)
  Top 1: ENCODER_RIGHT1.1 108.57,44.87 103.84,49.61 103.68,49.61 C2.1 105.05,50.03 107.07,52.04 v107.07,54.56 | v107.08,81.79 107.08,109.18 v106.97,109.29
  Bottom 1: v106.97,109.29 105.68,110.58 105.68,118.51 106.61,119.44 U2.6 | v107.07,54.56 107.07,81.78 v107.08,81.79
MUXA  (1 unrouted)
MUXB  (1 unrouted)
MUXC  (1 unrouted)
MUXD  (1 unrouted)
N$2
  Top 2: S1.2 91.84,102.54 84.99,109.39 D2.A
N$3
  Top 2: S1.1 97.54,106.55 102.12,101.97 102.12,96.18 95.65,89.71 94.31,89.71 BAT.1
N$4  (1 unrouted)
NET$15  (2 unrouted)
OUTL_A  (1 unrouted)
OUTL_B  (1 unrouted)
OUTL_C  (1 unrouted)
OUTL_D  (1 unrouted)
OUTR_A  (1 unrouted)
OUTR_B  (1 unrouted)
OUTR_C  (1 unrouted)
OUTR_D  (1 unrouted)
PIN1  (1 unrouted)
PIN2  (1 unrouted)
PIN3  (1 unrouted)
PIN4  (1 unrouted)
PIN5  (1 unrouted)
PIN6  (1 unrouted)
PIN7  (1 unrouted)
PIN8  (1 unrouted)
PIN9  (1 unrouted)
PIN10  (1 unrouted)
PIN11  (1 unrouted)
PWMA
  Top 0.508: U1.16 24.37,133.84 46.16,112.05 46.16,96.53 47.63,95.05 JP6.4
PWMB
  Bottom 0.508: JP6.5 49.26,97.59 43.89,102.96 43.89,111.58 36.88,118.6 U1.10
PWMC  (via drill 0.8)  (1 unrouted)
  Top 0.508: U2.16 88.48,132.14 74.97,118.63 v74.97,115.68
  Bottom 0.508: v74.97,115.68 74.97,86.8 70.35,82.18 64.02,82.18 53.36,92.84 53.36,105.59 51.26,107.69 50.5,107.69
PWMD
  Top 0.508: JP6.10 52.82,110.29 55.42,107.69 55.42,85.96 57.2,84.17 69.83,84.17 76.57,90.92 76.57,112.27 81.2,116.9 U2.10
RX0  (1 unrouted)
RX1  (1 unrouted)
S1  (1 unrouted)
S1_OUT  (2 unrouted)
S2  (1 unrouted)
S2_OUT  (2 unrouted)
S3  (1 unrouted)
S3_OUT  (2 unrouted)
S4  (1 unrouted)
S4_OUT  (2 unrouted)
SCL  (4 unrouted)
SDA  (4 unrouted)
TX0  (1 unrouted)
TX1  (1 unrouted)
V0  (1 unrouted)
VCC  (15 unrouted)
  pour Bottom: -16.77,-30.1 -16.77,209.78 148.3,209.78 148.3,-41.25 -16.76,-41.25 -16.76,-30.01
VCC_OUT  (1 unrouted)
VIN
  Top 2: D2.C 83.66,92.96 77.3,86.59 | 77.3,86.59 77.3,86.43 87.46,76.27 | 87.46,76.27 90.96,72.77 IC1.1 92.77,72.45 C9.1 | AMS1117.3 17.96,97.49 20.75,94.7 20.75,93.22 C4.1 20.85,92.78 28.71,84.92 35.55,84.92 44.43,76.04 66.74,76.04 77.3,86.59 | JP8.1 87.46,51.57 | 87.46,51.57 87.46,76.27 | 87.46,51.57 56.55,51.57 54.24,49.26 54.24,34.27 JP1.1
VMOT
  Bottom 2: U1.1 5.4,133.84 2.22,130.66 2.22,111.93 3.7,110.44 29.55,110.44 31.95,108.04 31.95,88.35 39.08,81.22 53.77,81.22 JP4.1 59.21,76.69 80.55,76.69 89.47,85.6 108.13,85.6 111.42,88.9 111.42,130.73 110.01,132.14 U2.1